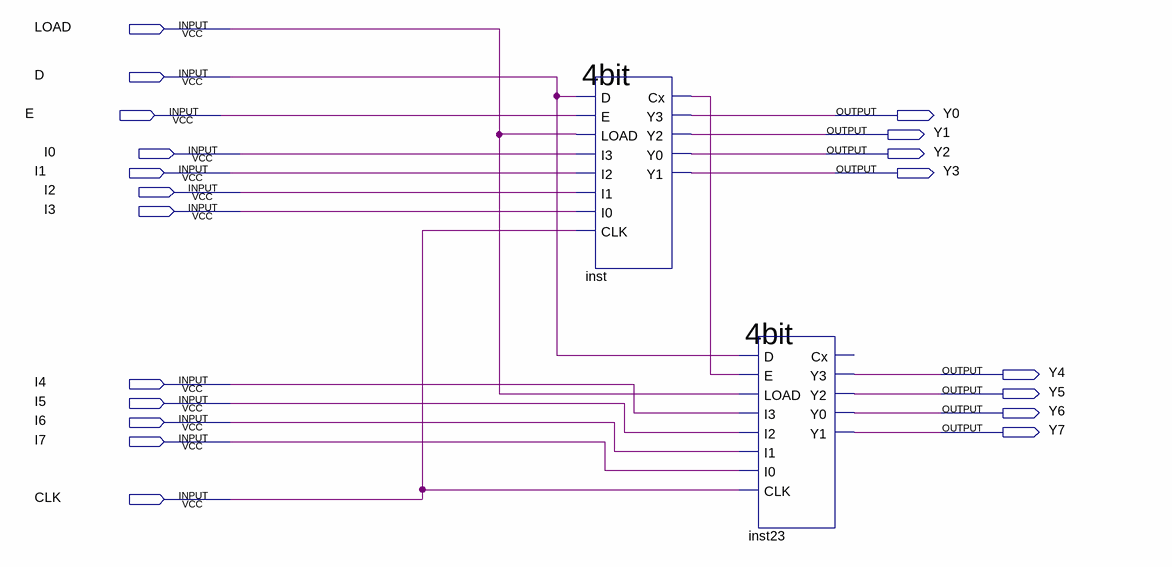
[diagram p0: schematic sheet]
// Quartus schematic Block5.bdf as structural Verilog: 2 symbols, 20 pins
module Block5 (
  input  LOAD,
  input  D,
  input  E,
  input  I0,
  input  I1,
  input  I2,
  input  I3,
  input  I4,
  input  I5,
  input  I6,
  input  I7,
  input  CLK,
  output Y0,
  output Y1,
  output Y2,
  output Y3,
  output Y4,
  output Y5,
  output Y6,
  output Y7
);

  wire inst_cx;

  \4bit  inst (
    .D(D), .E(E), .LOAD(LOAD), .I3(I0), .I2(I1), .I1(I2), .I0(I3), .CLK(CLK), .Cx(inst_cx), .Y3(Y0), .Y2(Y1),
    .Y0(Y2), .Y1(Y3));
  \4bit  inst23 (
    .D(D), .E(inst_cx), .LOAD(LOAD), .I3(I4), .I2(I5), .I1(I6), .I0(I7), .CLK(CLK), .Y3(Y4), .Y2(Y5),
    .Y0(Y6), .Y1(Y7));  // open: Cx
endmodule
